# EAGLE design PIC32_breakout (EAGLE 5.12)
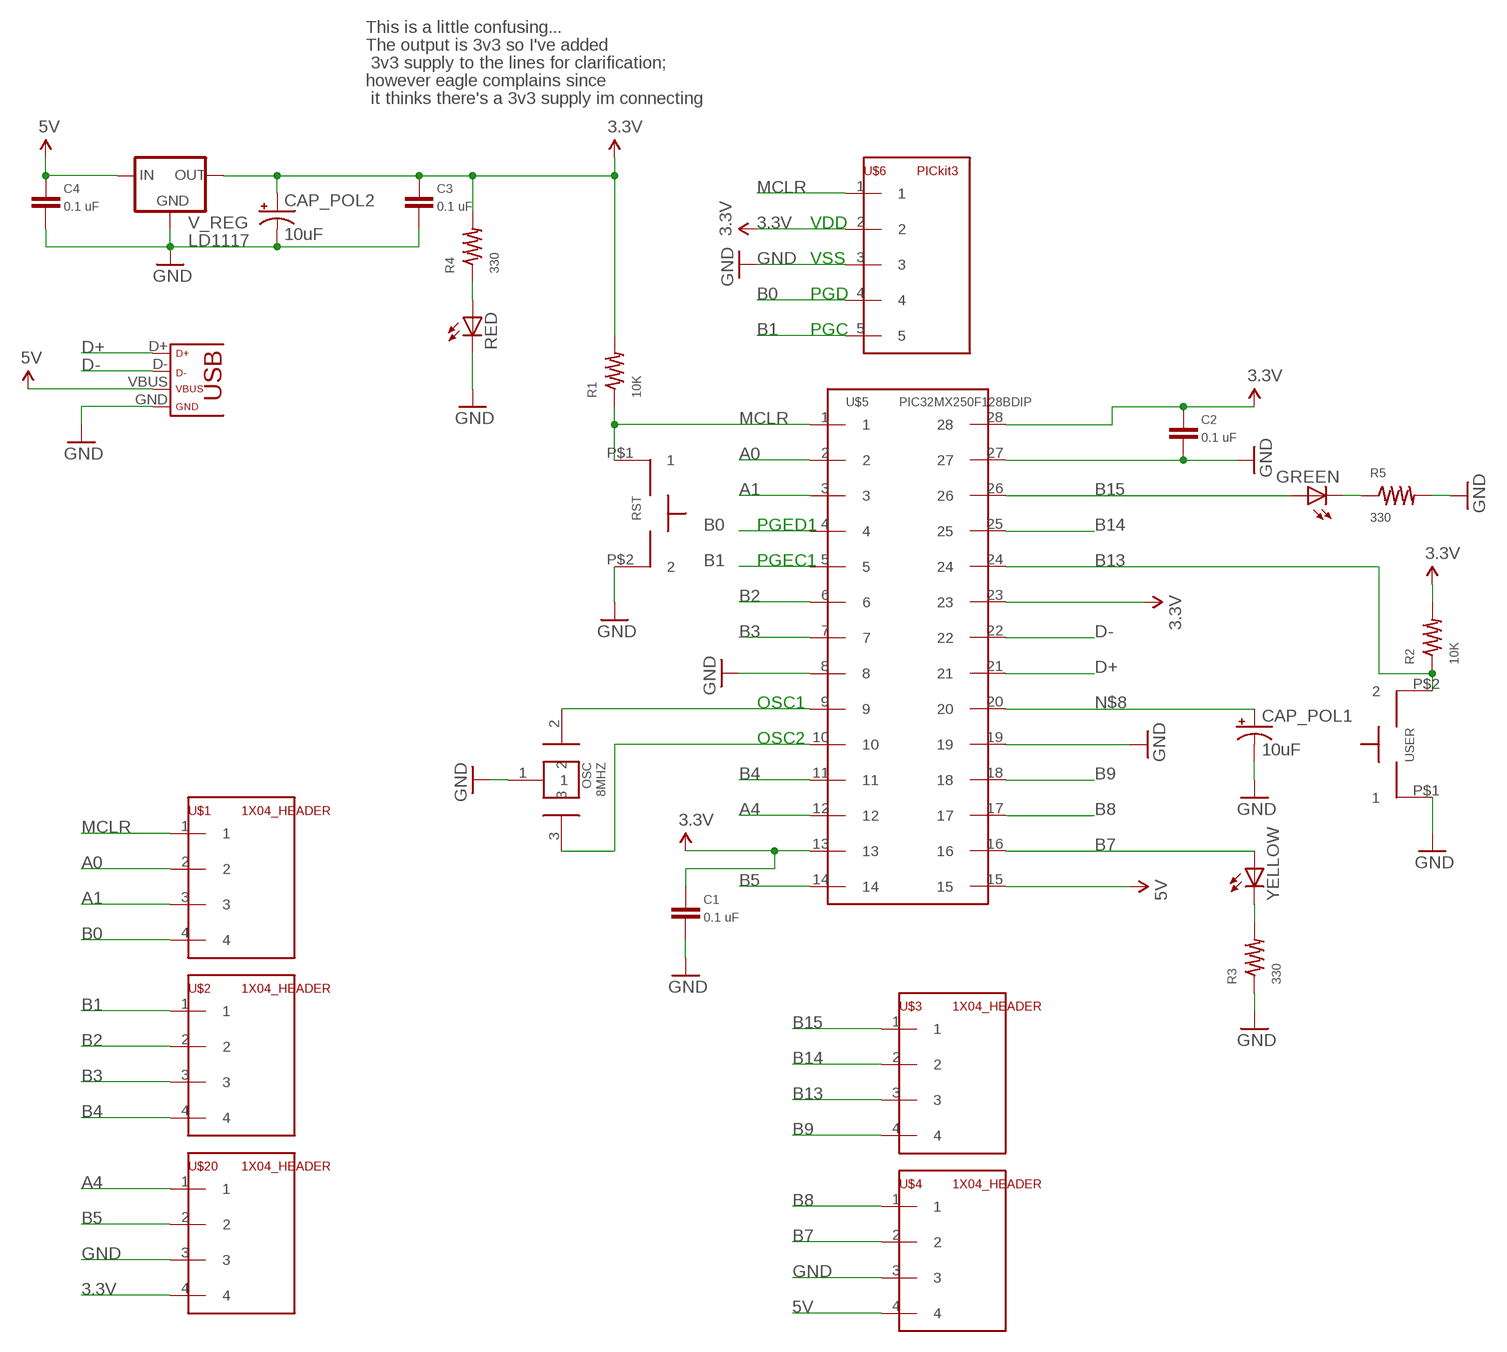
[diagram p0: schematic, sheet 1]

## Parts
8MHZ  OSC  RESONATOR  [RESONATOR]
C1  0.1 uF  CAPACITOR1  [C025-025X050]
C2  0.1 uF  CAPACITOR1  [C025-025X050]
C3  0.1 uF  CAPACITOR1  [C025-025X050]
C4  0.1 uF  CAPACITOR1  [C025-025X050]
CAP_POL1  10uF  CAP_POL  [CAP_POL_D]
CAP_POL2  10uF  CAP_POL  [CAP_POL_D]
GREEN  LED3MM  [LED3MM]
R1  10K  RESISTOR207/10  [0207/10]
R2  10K  RESISTOR207/10  [0207/10]
R3  330  RESISTOR207/10  [0207/10]
R4  330  RESISTOR207/10  [0207/10]
R5  330  RESISTOR207/10  [0207/10]
RED  LED3MM  [LED3MM]
RST  PUSH_BTN  [PUSH_BTN]
U$1  1X04_HEADER  [1X04]
U$2  1X04_HEADER  [1X04]
U$3  1X04_HEADER  [1X04]
U$4  1X04_HEADER  [1X04]
U$5  PIC32MX250F128BDIP  [2X14]
U$6  PICkit3  1X05_HEADER  [1X05]
U$10  USB  [USB-MINIB]
U$20  1X04_HEADER  [1X04]
USER  PUSH_BTN  [PUSH_BTN]
V_REG  LD1117  [TO220]
YELLOW  LED3MM  [LED3MM]

## Nets
3.3V: C1.2 C2.2 C3.2 CAP_POL2.1(+) R1.2 R2.2 R4.2 U$5.13 U$5.23 U$5.28 U$6.2 U$20.4 V_REG.2(OUT)
5V: C4.2 U$4.4 U$5.15 U$10.VBUS V_REG.3(IN)
A0: U$1.2 U$5.2
A1: U$1.3 U$5.3
A4: U$5.12 U$20.1
B0: U$1.4 U$5.4 U$6.4
B1: U$2.1 U$5.5 U$6.5
B2: U$2.2 U$5.6
B3: U$2.3 U$5.7
B4: U$2.4 U$5.11
B5: U$5.14 U$20.2
B7: U$4.2 U$5.16 YELLOW.A
B8: U$4.1 U$5.17
B9: U$3.4 U$5.18
B13: R2.1 U$3.3 U$5.24 USER.P$2
B14: U$3.2 U$5.25
B15: GREEN.A U$3.1 U$5.26
D+: U$5.21 U$10.D+
D-: U$5.22 U$10.D-
GND: 8MHZ.1 C1.1 C2.1 C3.1 C4.1 CAP_POL1.2(-) CAP_POL2.2(-) R3.1 R5.2 RED.K(C) RST.P$2 U$4.3 U$5.8 U$5.19 U$5.27 U$6.3 U$10.GND U$20.3 USER.P$1 V_REG.1(GND)
MCLR: R1.1 RST.P$1 U$1.1 U$5.1 U$6.1
N$1: 8MHZ.2 U$5.9
N$2: 8MHZ.3 U$5.10
N$3: R3.2 YELLOW.K(C)
N$5: R4.1 RED.A
N$8: CAP_POL1.1(+) U$5.20
R5: GREEN.K(C) R5.1

## Notes on the sheet
- This is a little confusing...
- The output is 3v3 so I've added
- 3v3 supply to the lines for clarification;
- however eagle complains since
- it thinks there's a 3v3 supply im connecting
- VDD
- VSS
- PGD
- PGC
- PGED1
- PGEC1
- OSC1
- OSC2

## Library data of the parts
8MHZ = ME433:RESONATOR
C1-C4 = ME433:CAPACITOR
CAP_POL1 CAP_POL2 = ME433:CAP_POL
GREEN RED YELLOW = led:LED: LED OSRAM: - CHIPLED LG R971, LG N971, LY N971, LG Q971, LY Q971, LO R971, LY R971 LH N974, LH R974 LS Q976, LO Q976, LY Q976 LO Q996 - Hyper CHIPLED LW Q18S LB Q993, LB Q99A, LB R99A - SideLED LS A670, LO A670, LY A670, LG A670, LP A670 LB A673, LV A673, LT A673, LW A673 LH A674 LY A675 LS A676, LA A676, LO A676, LY A676, LW A676 LS A679, LY A679, LG A679 - Hyper Micro SIDELED® LS Y876, LA Y876, LO Y876, LY Y876 LT Y87S - SmartLED LW L88C, LW L88S LB L89C, LB L89S, LG L890 LS L89K, LO L89K, LY L89K LS L896, LA L896, LO L896, LY L896 - TOPLED LS T670, LO T670, LY T670, LG T670, LP T670 LSG T670, LSP T670, LSY T670, LOP T670, LYG T670 LG T671, LOG T671, LSG T671 LB T673, LV T673, LT T673, LW T673 LH T674 LS T676, LA T676, LO T676, LY T676, LB T676, LH T676, LSB T676, LW T676 LB T67C, LV T67C, LT T67C, LS T67K, LO T67K, LY T67K, LW E67C LS E67B, LA E67B, LO E67B, LY E67B, LB E67C, LV E67C, LT E67C LW T67C LS T679, LY T679, LG T679 LS T770, LO T770, LY T770, LG T770, LP T770 LB T773, LV T773, LT T773, LW T773 LH T774 LS E675, LA E675, LY E675, LS T675 LS T776, LA T776, LO T776, LY T776, LB T776 LHGB T686 LT T68C, LB T68C - Hyper Mini TOPLED® LB M676 - Mini TOPLED Santana® LG M470 LS M47K, LO M47K, LY M47K Source: http://www.osram.convergy.de LUXEON: - LUMILED® LXK2-PW12-R00, LXK2-PW12-S00, LXK2-PW14-U00, LXK2-PW14-V00 LXK2-PM12-R00, LXK2-PM12-S00, LXK2-PM14-U00 LXK2-PE12-Q00, LXK2-PE12-R00, LXK2-PE12-S00, LXK2-PE14-T00, LXK2-PE14-U00 LXK2-PB12-K00, LXK2-PB12-L00, LXK2-PB12-M00, LXK2-PB14-N00, LXK2-PB14-P00, LXK2-PB14-Q00 LXK2-PR12-L00, LXK2-PR12-M00, LXK2-PR14-Q00, LXK2-PR14-R00 LXK2-PD12-Q00, LXK2-PD12-R00, LXK2-PD12-S00 LXK2-PH12-R00, LXK2-PH12-S00 LXK2-PL12-P00, LXK2-PL12-Q00, LXK2-PL12-R00 Source: www.luxeon.com KINGBRIGHT: KA-3528ASYC Source: www.kingbright.com
R1-R5 = ME433:RESISTOR
RST USER = ME433:PUSH_BTN
U$1-U$4 U$20 = ME433:1X04_HEADER
U$5 = ME433:PIC32MX250F128B
U$6 = ME433:1X05_HEADER
U$10 = ME433:USB
V_REG = ME433:LD1117

## Board
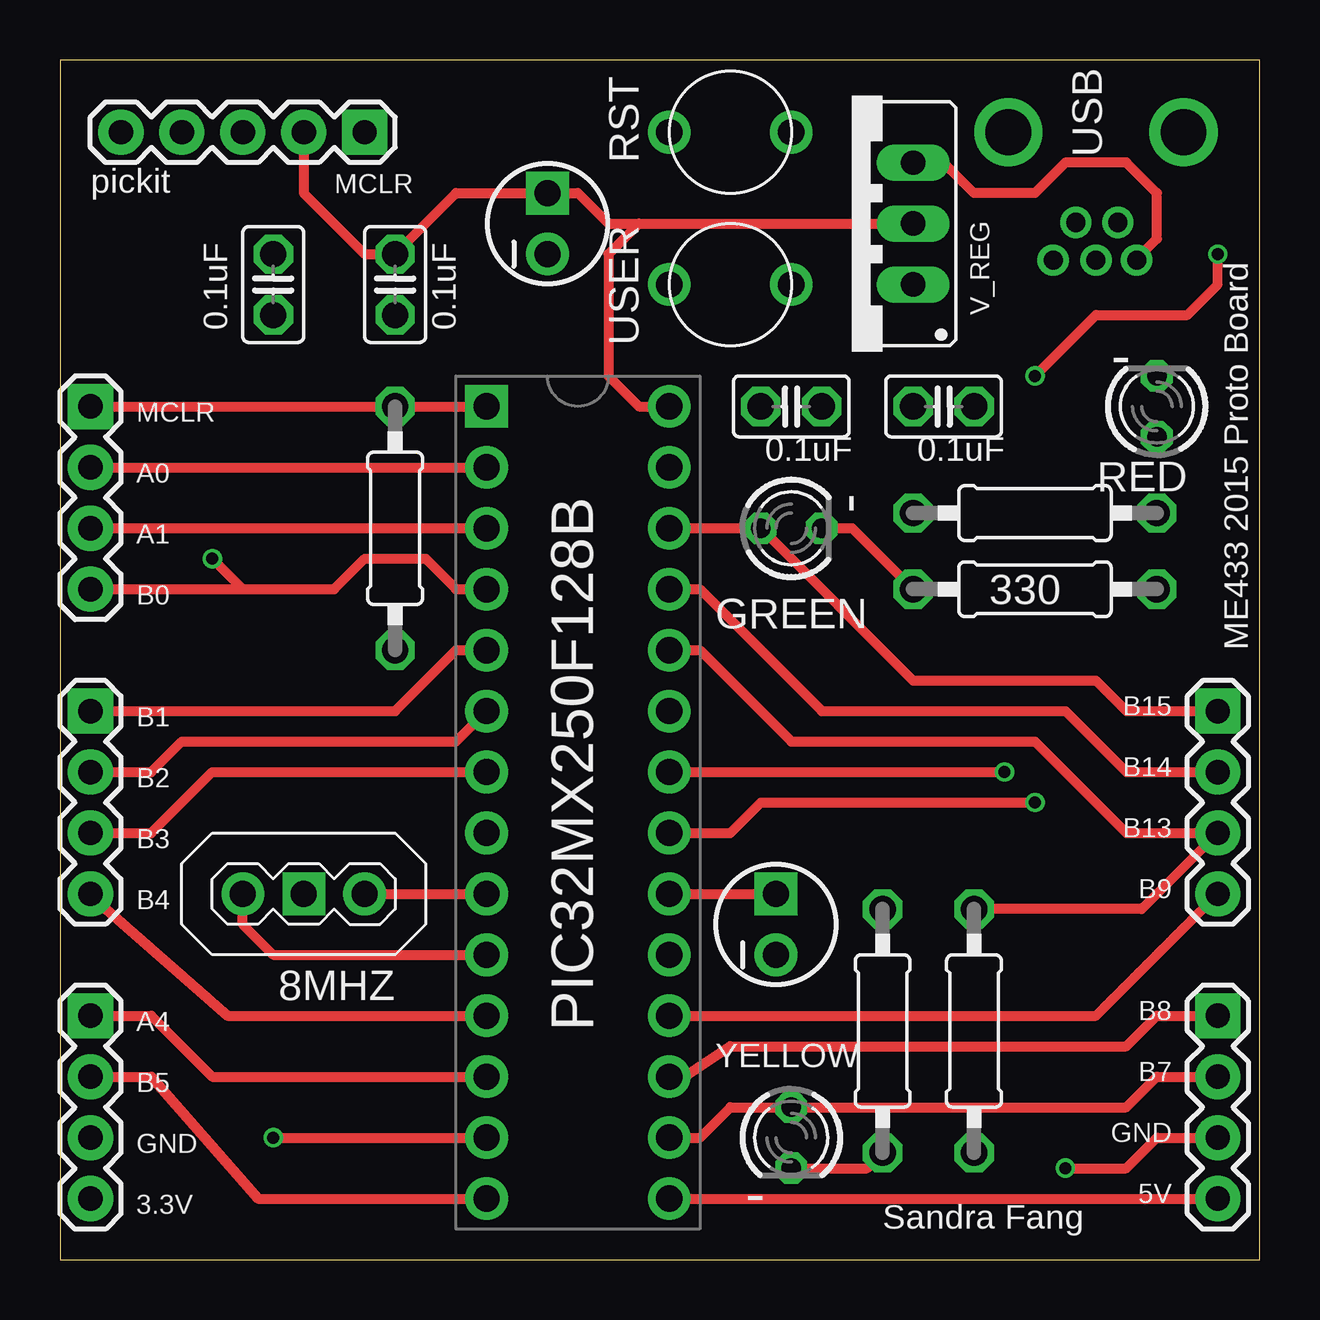
[diagram p1: board, top side]
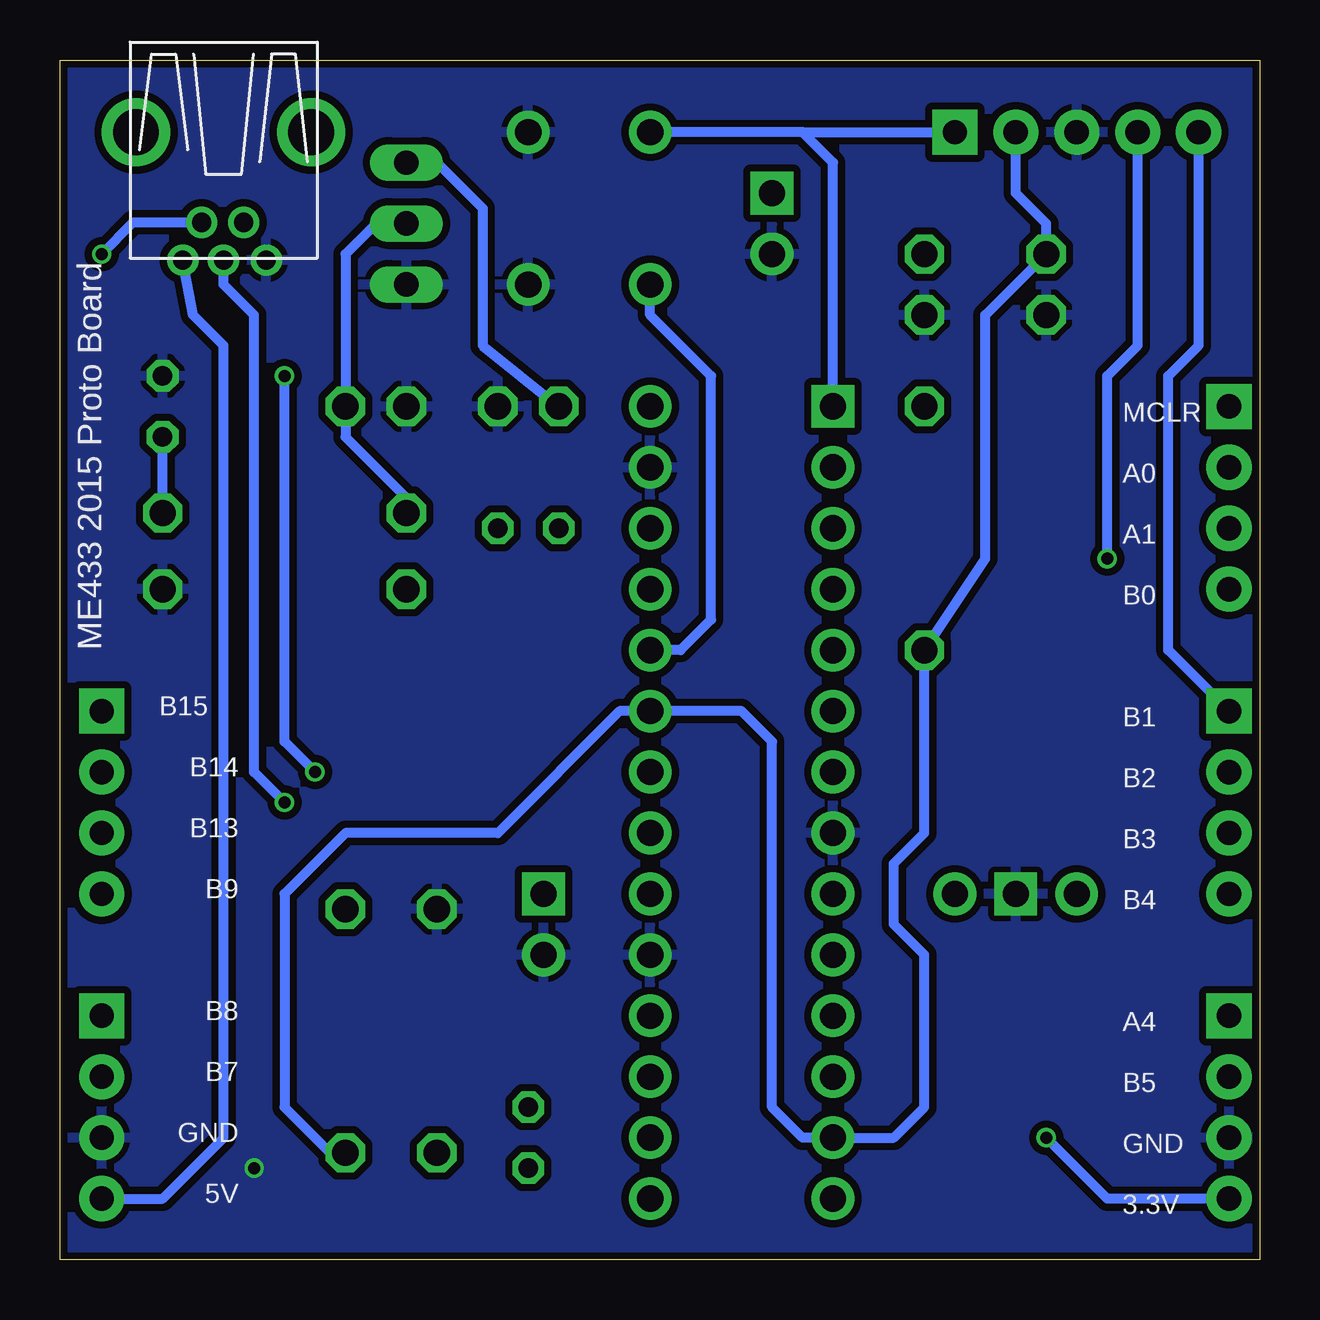
[diagram p2: board, bottom side, seen from below]

Size 50 x 50 mm. Coordinates in mm from the lower left corner, seen from the top.
Outline: 0,0 50,0 50,50 0,50 0,0
Copper layers (1*16): Top 0.035mm / dielectric 1.5mm / Bottom 0.035mm
Design rules "SeeedStudio_2layer_DRU_no_angle_20140221": minimum track width 6mil, minimum drill 12mil, track to track 6mil, track to pad 6mil, pad to pad 6mil, via to via 6mil, smd to smd 0mil, copper to edge 10mil, drill to drill 10mil, minimum pad ring 10mil, minimum via ring 6mil, stop-mask expansion 2mil, vias tented up to drill 100mil, thermal gap 10mil

### Footprints (pad centres in the part's own frame; a part is rotated, then mirrored left to right if it is on the bottom)
RESONATOR = drill 1.092 pad 1.778 square: 1 0,0 | drill 1.092 pad 1.778 round: 2 -2.54,0; 3 2.54,0
C025-025X050 = drill 1.092 octagon: 1 -1.27,0; 2 1.27,0
CAP_POL_D = drill 1.092 pad 1.778 square: 1 1.27,0 | drill 1.092 pad 1.778 round: 2 -1.27,0
LED3MM = drill 0.813 octagon: A -1.27,0; K 1.27,0
0207/10 = drill 1.092 octagon: 1 -5.08,0; 2 5.08,0
PUSH_BTN = drill 1.092 pad 1.778 round: P$1 -2.54,0; P$2 2.54,0
1X04 = drill 1.016 pad 1.88 square: 1 0,0 | drill 1.016 pad 1.88 round: 2 2.54,0; 3 5.08,0; 4 7.62,0
2X14 = drill 1.092 pad 1.778 square: 1 1.27,34.29 | drill 1.092 pad 1.778 round: 2 1.27,31.75; 3 1.27,29.21; 4 1.27,26.67; 5 1.27,24.13; 6 1.27,21.59; 7 1.27,19.05; 8 1.27,16.51; 9 1.27,13.97; 10 1.27,11.43; 11 1.27,8.89; 12 1.27,6.35; 13 1.27,3.81; 14 1.27,1.27; 15 8.89,1.27; 16 8.89,3.81; 17 8.89,6.35; 18 8.89,8.89; 19 8.89,11.43; 20 8.89,13.97; 21 8.89,16.51; 22 8.89,19.05; 23 8.89,21.59; 24 8.89,24.13; 25 8.89,26.67; 26 8.89,29.21; 27 8.89,31.75; 28 8.89,34.29
1X05 = drill 1.016 pad 1.88 square: 1 0,0 | drill 1.016 pad 1.88 round: 2 2.54,0; 3 5.08,0; 4 7.62,0; 5 10.16,0
USB-MINIB = drill 0.8 round: D+ 4.064,0; D- 2.489,0.914; GND 4.064,-1.778; ID 2.489,-0.838; VBUS 4.064,1.702 | drill 1.9 round: P$6 -1.27,-3.65; P$7 -1.27,3.65
TO220 = drill 1.016 long: 1 -2.54,0; 2 0,0; 3 2.54,0

### Placement (x,y rotation side)
8MHZ  10.16,15.24 180 top
C1  8.89,40.64 90 top
C2  13.97,40.64 90 top
C3  36.83,35.56 0 top
C4  30.48,35.56 180 top
CAP_POL1  29.84,13.97 90 top
CAP_POL2  20.32,43.18 90 top
GREEN  30.48,30.48 0 top
R1  13.97,30.48 270 top
R2  38.1,9.53 270 top
R3  34.29,9.53 270 top
R4  40.64,31.11 180 top
R5  40.64,27.94 0 top
RED  45.72,35.56 90 top
RST  27.94,46.99 0 top
U$1  1.27,35.56 270 top
U$2  1.27,22.86 270 top
U$3  48.26,22.86 270 top
U$4  48.26,10.16 270 top
U$5  16.51,1.27 0 top
U$6  12.7,46.99 180 top
U$10  43.18,45.72 270 top
U$20  1.27,10.16 270 top
USER  27.94,40.64 180 top
V_REG  35.56,43.18 90 top
YELLOW  30.48,5.08 270 top

### Tracks (layer width: path | path; a pad name or v marks a point on that pad's centre or on a via)
3.3V  (via drill 0.5)
  Top 0.406: v8.89,5.08 U$5.13 | 24.13,43.18 22.86,43.18 21.59,44.45 CAP_POL2.1 16.51,44.45 C2.2 12.7,41.91 10.16,44.45 U$6.2 | 24.13,43.18 V_REG.2 | U$5.28 24.13,35.56 22.86,36.83 22.86,41.91 24.13,43.18
  Bottom 0.406: v8.89,5.08 6.35,2.54 U$20.4 | U$6.2 10.16,44.45 8.89,43.18 C1.2 11.43,39.37 11.43,29.21 R1.2 13.97,17.78 15.24,16.51 15.24,13.97 13.97,12.7 13.97,6.35 15.24,5.08 U$5.13 19.05,5.08 20.32,6.35 20.32,21.59 21.59,22.86 U$5.23 26.67,22.86 31.75,17.78 38.1,17.78 40.64,15.24 40.64,6.35 38.73,4.45 R2.2 | V_REG.2 36.83,43.18 38.1,41.91 C3.2 38.1,34.29 35.56,31.75 R4.2
5V
  Top 0.406: U$5.15 U$4.4 | V_REG.3 36.83,45.72 38.1,44.45 40.64,44.45 41.91,45.72 44.45,45.72 45.72,44.45 45.72,42.55 44.88,41.71 U$10.VBUS
  Bottom 0.406: U$10.VBUS 44.45,39.37 43.18,38.1 43.18,37.64 43.18,5.08 45.72,2.54 U$4.4 | V_REG.3 34.29,45.72 32.38,43.81 32.38,38.1 C4.2
A0
  Top 0.406: U$1.2 U$5.2
A1
  Top 0.406: U$1.3 U$5.3
A4
  Top 0.406: U$20.1 3.81,10.16 6.35,7.62 U$5.12
B0  (via drill 0.5)
  Top 0.406: U$1.4 7.62,27.94 | 7.62,27.94 v6.35,29.21 | 7.62,27.94 11.43,27.94 12.7,29.21 15.24,29.21 16.51,27.94 U$5.4
  Bottom 0.406: U$6.4 5.08,38.1 6.35,36.83 v6.35,29.21
B1
  Top 0.406: U$2.1 13.97,22.86 16.51,25.4 U$5.5
  Bottom 0.406: U$2.1 3.81,25.4 3.81,36.83 2.54,38.1 U$6.5
B2
  Top 0.406: U$2.2 3.81,20.32 5.08,21.59 16.51,21.59 U$5.6
B3
  Top 0.406: U$5.7 6.35,20.32 3.81,17.78 U$2.3
B4
  Top 0.406: U$2.4 1.91,14.61 6.99,10.16 U$5.11
B5
  Top 0.406: U$20.2 3.81,7.62 8.26,2.54 U$5.14
B7
  Top 0.406: U$5.16 26.67,5.08 27.94,6.35 YELLOW.A 44.45,6.35 45.72,7.62 U$4.2
B8
  Top 0.406: U$5.17 26.04,7.62 27.94,8.89 44.45,8.89 45.72,10.16 U$4.1
B9
  Top 0.406: U$5.18 43.18,10.16 U$3.4
B13
  Top 0.406: U$5.24 26.67,25.4 30.48,21.59 40.64,21.59 44.45,17.78 U$3.3 45.09,14.61 R2.1
  Bottom 0.406: U$5.24 24.13,25.4 22.86,26.67 22.86,36.83 25.4,39.37 USER.P$2
B14
  Top 0.406: U$3.2 44.45,20.32 41.91,22.86 31.75,22.86 26.67,27.94 U$5.25
B15
  Top 0.406: U$5.26 GREEN.A 35.56,24.13 43.18,24.13 44.45,22.86 U$3.1
D+  (via drill 0.5)
  Top 0.406: U$5.21 27.94,17.78 29.21,19.05 v40.64,19.05
  Bottom 0.406: U$10.D+ 43.18,40.64 41.91,39.37 41.91,20.32 v40.64,19.05
D-  (via drill 0.5)
  Top 0.406: U$5.22 v39.37,20.32 | v40.64,36.83 43.18,39.37 46.99,39.37 48.26,40.64 v48.26,41.91
  Bottom 0.406: v39.37,20.32 40.64,21.59 v40.64,36.83 | v48.26,41.91 46.94,43.23 U$10.D-
GND  (via drill 0.5)
  Top 0.406: U$4.3 45.72,5.08 44.45,3.81 v41.91,3.81
  pour Bottom (isolate 0.305): -1.27,50.8 50.8,50.8 50.8,-1.27 -1.27,-1.27
MCLR
  Top 0.406: U$1.1 R1.1 U$5.1
  Bottom 0.406: U$5.1 17.78,45.72 19.05,46.99 | 19.05,46.99 RST.P$1 | 19.05,46.99 U$6.1
N$1
  Top 0.406: 8MHZ.2 U$5.9
N$2
  Top 0.406: U$5.10 8.89,12.7 7.62,13.97 8MHZ.3
N$3
  Top 0.406: YELLOW.K 33.66,3.81 R3.2
N$5
  Bottom 0.406: R4.1 RED.A
N$8
  Top 0.406: U$5.20 CAP_POL1.1
R5
  Top 0.406: GREEN.K 33.02,30.48 R5.1

### Text on the board
tPlace: pickit | MCLR | 0.1uF | 0.1uF | - | MCLR | 0.1uF | 0.1uF | A0 | - | A1 | B0 | 330 | ME433 2015 Proto Board | B15 | B1 | B14 | B2 | B13 | B3 | B9 | B4 | B8 | A4 | PIC32MX250F128B | B7 | B5 | GND | GND | 5V | 3.3V | - | Sandra Fang
bPlace: MCLR | A0 | A1 | B0 | ME433 2015 Proto Board | B15 | B1 | B14 | B2 | B13 | B3 | B9 | B4 | B8 | A4 | B7 | B5 | GND | GND | 5V | 3.3V